# EAGLE design UPTC (EAGLE 9.5.2)
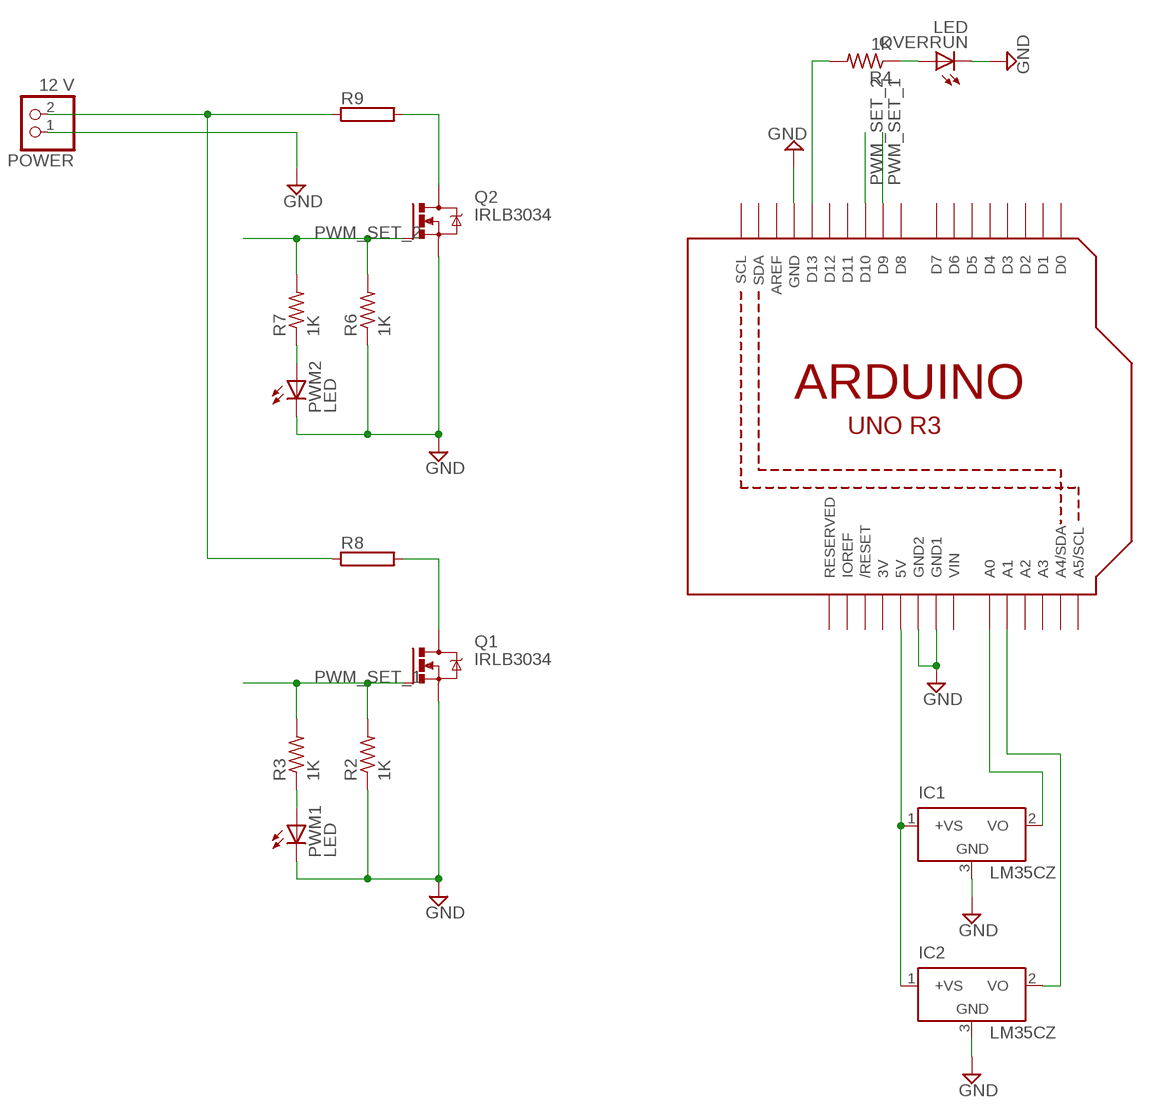
[diagram p0: schematic, sheet 1]

## Parts
IC1  LM35CZ  [TO92]
IC2  LM35CZ  [TO92]
OVERRUN  LED  LED5MM  [LED5MM]
POWER  12 V  PINHD-1X2  [1X02]
PWM1  LED  LED5MM  [LED5MM]
PWM2  LED  LED5MM  [LED5MM]
Q1  IRLB3034  IRF520  [TO220BV]
Q2  IRLB3034  IRF520  [TO220BV]
R2  1K  R-US_0207/10  [0207/10]
R3  1K  R-US_0207/10  [0207/10]
R4  1K  R-US_0207/10  [0207/10]
R6  1K  R-US_0207/10  [0207/10]
R7  1K  R-US_0207/10  [0207/10]
R8  RAC05  [AC05]
R9  RAC05  [AC05]
U2  ARDUINOR3-BPLACE  [ARDUINOR3-BPLACE]

## Nets
GND: IC1.3(GND) IC2.3(GND) OVERRUN.K(C) POWER.1 PWM1.K(C) PWM2.K(C) Q1.S Q2.S R2.1 R6.1 U2.GND U2.GND1 U2.GND2
N$2: Q1.D R8.2
N$4: IC1.2(VO) U2.A0
N$5: R4.2 U2.D13
N$6: PWM1.A R3.1
N$7: OVERRUN.A R4.1
N$8: IC2.2(VO) U2.A1
N$9: Q2.D R9.2
N$10: PWM2.A R7.1
N$11: POWER.2 R8.1 R9.1
PWM_SET_1: Q1.G R2.2 R3.2 U2.D9
PWM_SET_2: Q2.G R6.2 R7.2 U2.D10
VCC: IC1.1(+VS) IC2.1(+VS) U2.5V
Unconnected: U2.A2 U2.A3 U2.A4(A4/SDA) U2.A5(A5/SCL) U2.AREF U2.D0 U2.D1 U2.D2 U2.D3 U2.D4 U2.D5 U2.D6 U2.D7 U2.D8 U2.D11 U2.D12 U2.IOREF U2.RESERVED U2.RESET(/RESET) U2.SCL U2.SDA

## Power pins joined to a net without a drawn wire
3V: U2.3V
VIN: U2.VIN

## Library data of the parts
IC1 IC2 = lm35:LM35: Single-Supply Centigrade Temperature Sensor Vout = (10mV/°C x Temp °C) +5mmmV Source: http://www.national.com/ds/LM/LM35.pdf
OVERRUN PWM1 PWM2 = adafruit:LED: LED OSRAM: - CHIPLED LG R971, LG N971, LY N971, LG Q971, LY Q971, LO R971, LY R971 LH N974, LH R974 LS Q976, LO Q976, LY Q976 LO Q996 - Hyper CHIPLED LW Q18S LB Q993, LB Q99A, LB R99A - SideLED LS A670, LO A670, LY A670, LG A670, LP A670 LB A673, LV A673, LT A673, LW A673 LH A674 LY A675 LS A676, LA A676, LO A676, LY A676, LW A676 LS A679, LY A679, LG A679 - Hyper Micro SIDELED® LS Y876, LA Y876, LO Y876, LY Y876 LT Y87S - SmartLED LW L88C, LW L88S LB L89C, LB L89S, LG L890 LS L89K, LO L89K, LY L89K LS L896, LA L896, LO L896, LY L896 - TOPLED LS T670, LO T670, LY T670, LG T670, LP T670 LSG T670, LSP T670, LSY T670, LOP T670, LYG T670 LG T671, LOG T671, LSG T671 LB T673, LV T673, LT T673, LW T673 LH T674 LS T676, LA T676, LO T676, LY T676, LB T676, LH T676, LSB T676, LW T676 LB T67C, LV T67C, LT T67C, LS T67K, LO T67K, LY T67K, LW E67C LS E67B, LA E67B, LO E67B, LY E67B, LB E67C, LV E67C, LT E67C LW T67C LS T679, LY T679, LG T679 LS T770, LO T770, LY T770, LG T770, LP T770 LB T773, LV T773, LT T773, LW T773 LH T774 LS E675, LA E675, LY E675, LS T675 LS T776, LA T776, LO T776, LY T776, LB T776 LHGB T686 LT T68C, LB T68C - Hyper Mini TOPLED® LB M676 - Mini TOPLED Santana® LG M470 LS M47K, LO M47K, LY M47K Source: http://www.osram.convergy.de/
POWER = pinhead:PINHD-1X2: PIN HEADER
Q1 Q2 = transistor-power:IRF520: HEXFET Power MOSFET
R2-R4 R6 R7 = adafruit:R-US_: RESISTOR, American symbol
R8 R9 = resistor-power:R: Power Resitor; OC_FARNELL: unknown; OC_NEWARK: unknown
U2 = adafruit:ARDUINOR3: This is a new object for the new Arduino R3 - with extra pins that you may want to use (such as IOref, and duplicated A4/A5

## Board
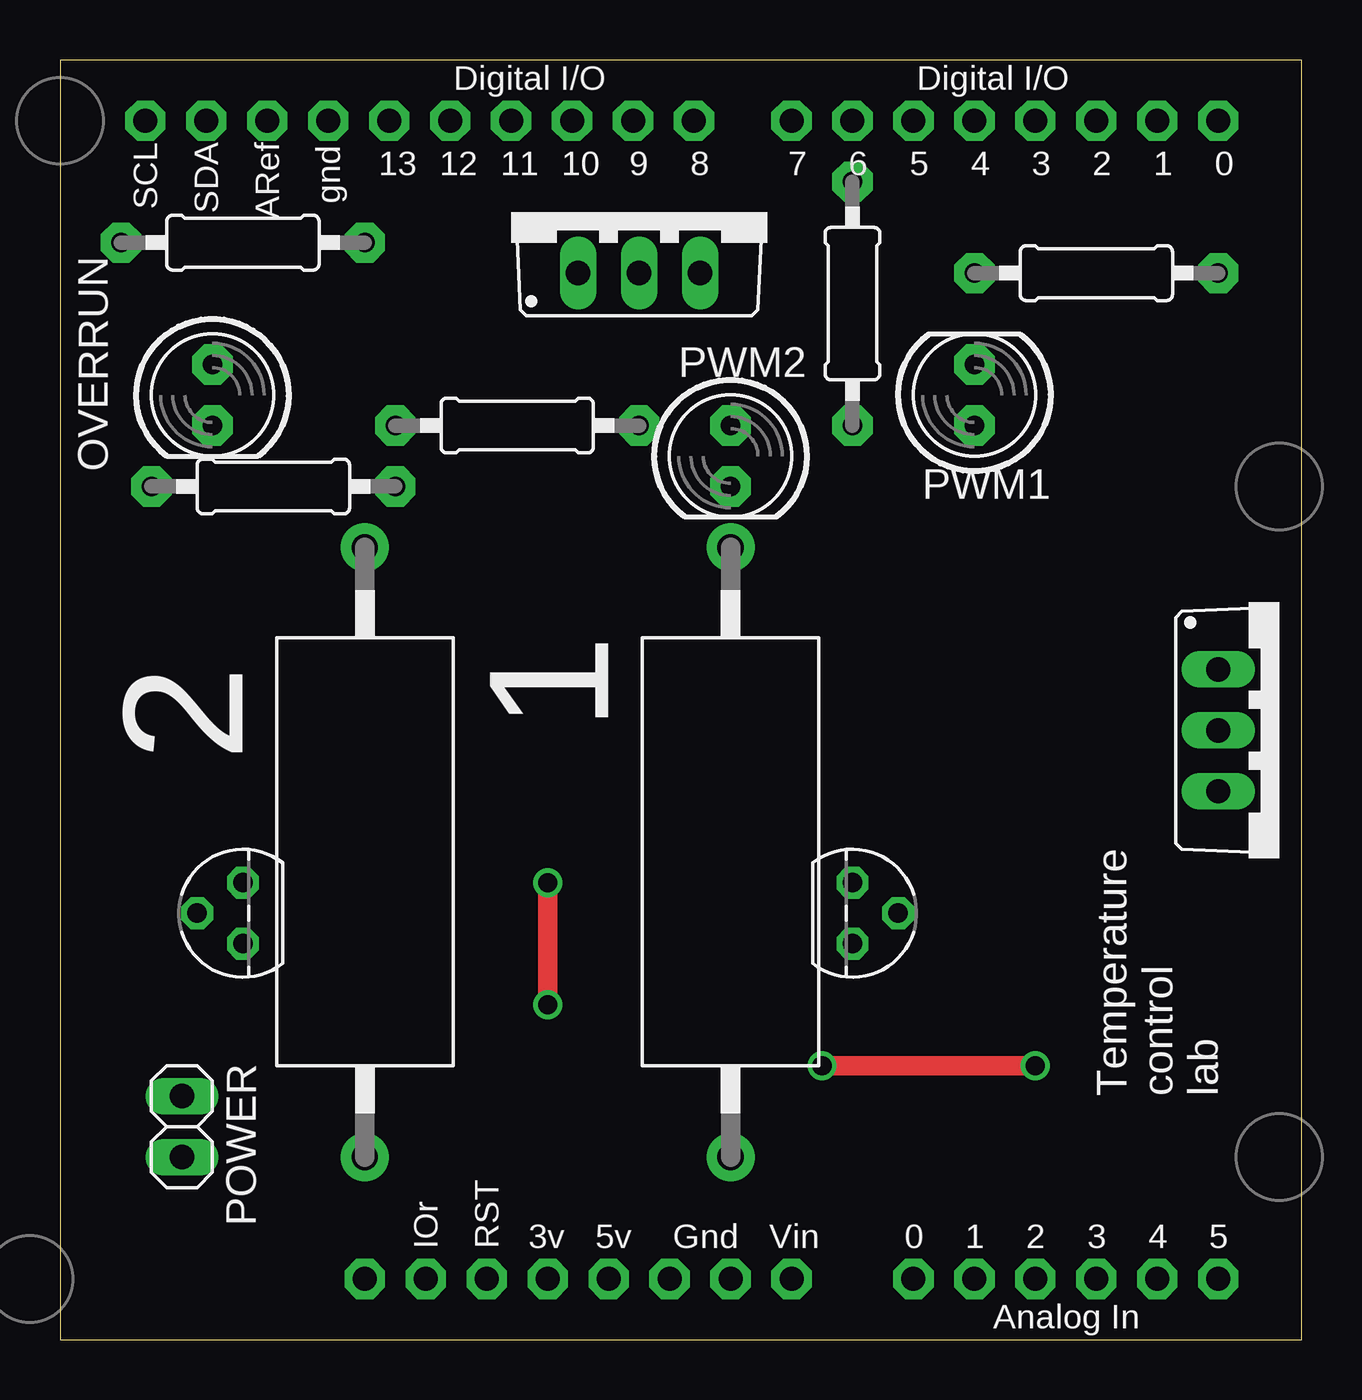
[diagram p1: board, top side]
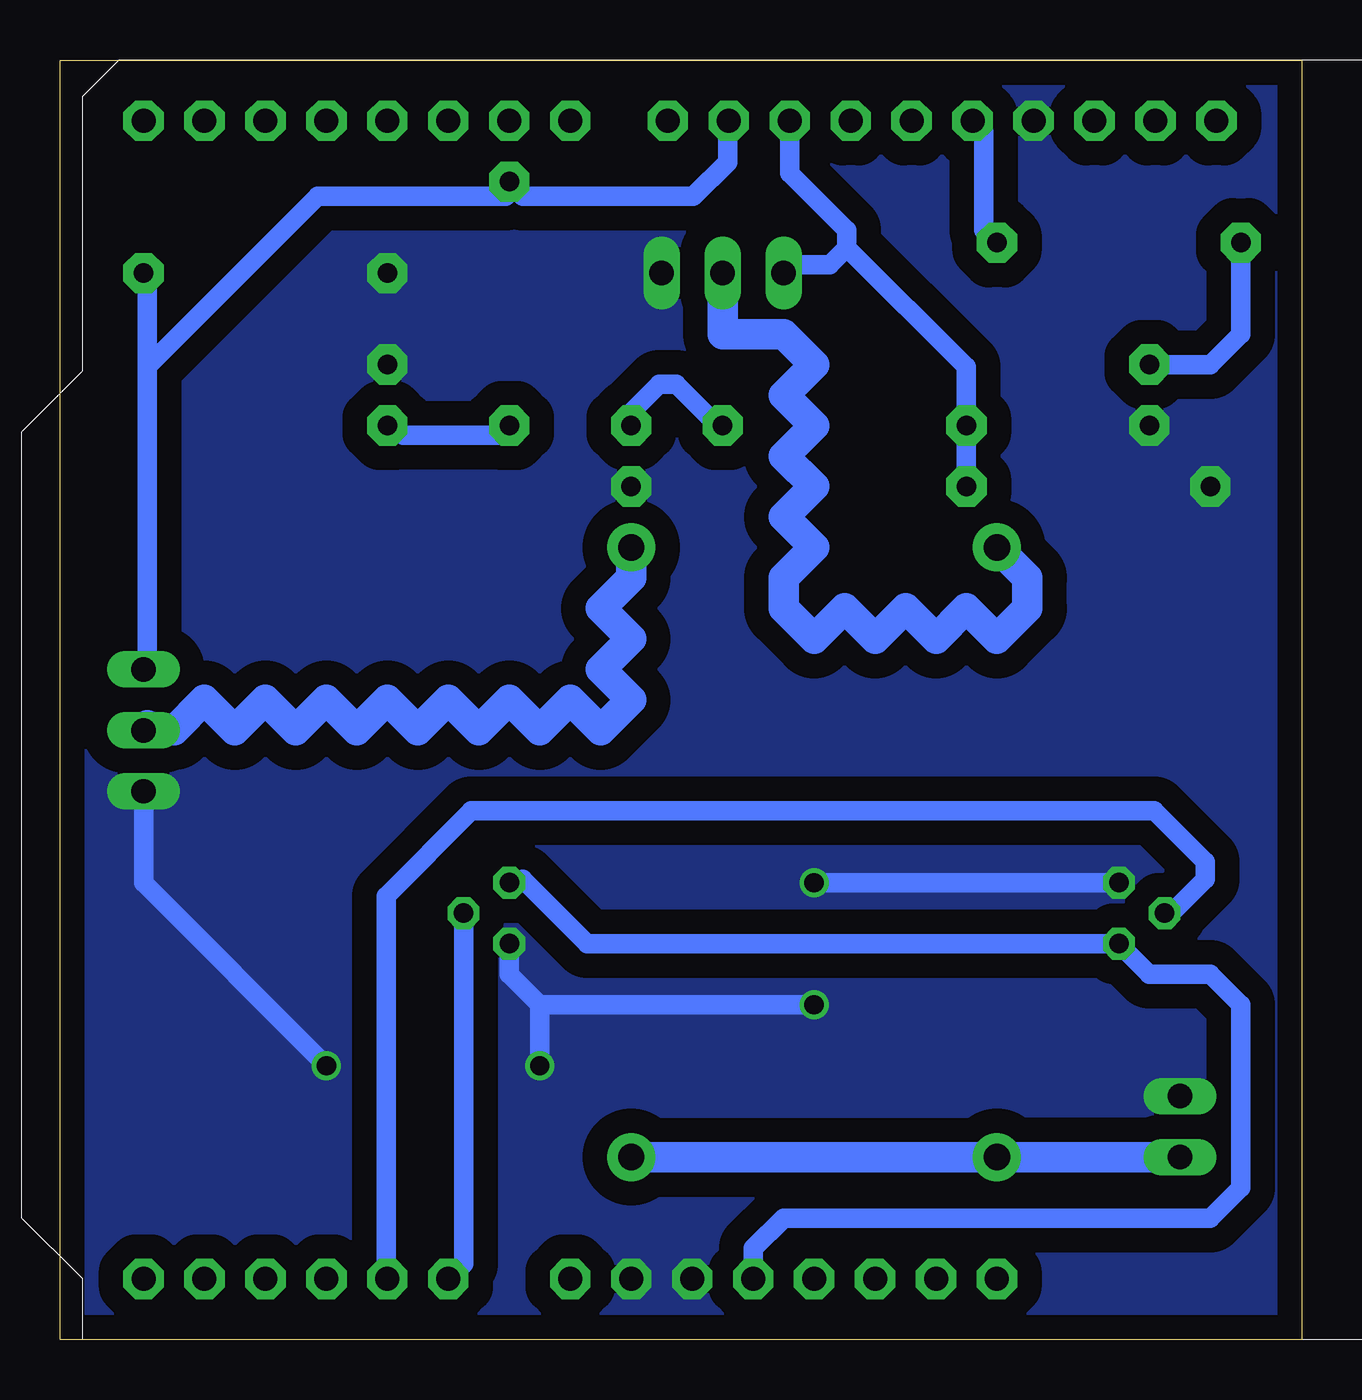
[diagram p2: board, bottom side, seen from below]

Size 51.74 x 53.33 mm. Coordinates in mm from the lower left corner, seen from the top.
Outline: 0,0 51.74,0 51.74,53.33 0,53.33 0,0
Copper layers (1*16): Top 0.035mm / dielectric 1.5mm / Bottom 0.035mm
Design rules "default *": minimum track width 32mil, minimum drill 0.8mm, track to track 24mil, track to pad 24mil, pad to pad 24mil, via to via 24mil, smd to smd 6mil, copper to edge 40mil, drill to drill 6mil, minimum pad ring 10mil, minimum via ring 8mil, stop-mask expansion 4mil, vias tented up to drill 0mil, thermal gap 0mil

### Footprints (pad centres in the part's own frame; a part is rotated, then mirrored left to right if it is on the bottom)
TO92 = drill 0.813 octagon: 1 -1.27,0; 2 0,1.905; 3 1.27,0
LED5MM = drill 0.813 pad 1.676 octagon: A -1.27,0; K 1.27,0
1X02 = drill 1.016 long: 1 -1.27,0; 2 1.27,0
TO220BV = drill 1.016 long: D 0,-2.54; G -2.54,-2.54; S 2.54,-2.54
0207/10 = drill 0.813 pad 1.676 octagon: 1 -5.08,0; 2 5.08,0
AC05 = drill 1.1 pad 2: 1 -12.7,0; 2 12.7,0
ARDUINOR3-BPLACE = drill 1 pad 1.676 octagon: 3V 35.56,2.54; 5V 38.1,2.54; A0 50.8,2.54; A1 53.34,2.54; A2 55.88,2.54; A3 58.42,2.54; A4 60.96,2.54; A5 63.5,2.54; AREF 23.876,50.8; D0 63.5,50.8; D1 60.96,50.8; D2 58.42,50.8; D3 55.88,50.8; D4 53.34,50.8; D5 50.8,50.8; D6 48.26,50.8; D7 45.72,50.8; D8 41.656,50.8; D9 39.116,50.8; D10 36.576,50.8; D11 34.036,50.8; D12 31.496,50.8; D13 28.956,50.8; GND 26.416,50.8; GND1 43.18,2.54; GND2 40.64,2.54; IOREF 30.48,2.54; RESERVED 27.94,2.54; RESET 33.02,2.54; SCL 18.796,50.8; SDA 21.336,50.8; VIN 45.72,2.54

### Placement (x,y rotation side)
IC1  33.02,17.78 270 top
IC2  7.62,17.78 90 top
OVERRUN  6.35,39.37 270 top
POWER  5.08,8.89 270 top
PWM1  38.1,39.37 90 top
PWM2  27.94,36.83 270 top
Q1  50.8,25.4 270 top
Q2  24.13,46.99 0 top
R2  43.18,44.45 0 top
R3  33.02,43.18 90 top
R4  7.62,45.72 0 top
R6  8.89,35.56 0 top
R7  19.05,38.1 180 top
R8  27.94,20.32 90 top
R9  12.7,20.32 90 top
U2  -15.24,0 0 top

### Tracks (layer width: path | path; a pad name or v marks a point on that pad's centre or on a via)
GND  (via drill 0.8)
  Top 0.813: v20.32,19.05 v20.32,13.97 | v31.75,11.43 v40.64,11.43
  Bottom 0.813: IC2.3 v20.32,19.05 | 31.75,13.97 33.02,15.24 IC1.3 | v20.32,13.97 31.75,13.97 | 31.75,13.97 v31.75,11.43 | v40.64,11.43 48.26,19.05 Q1.S
  pour Bottom (isolate 1.016): 0,53.34 52.07,53.34 52.07,0 0,0
N$2
  Bottom 0.813: 47.4,25.6 48.11,25.6 47.9,25.4 46.99,25.4
  Bottom 1.27: 48.11,25.6 Q1.D | 46.99,25.4 45.72,26.67 44.45,25.4 43.18,26.67 41.91,25.4 40.64,26.67 39.37,25.4 38.1,26.67 36.83,25.4 35.56,26.67 34.29,25.4 33.02,26.67 31.75,25.4 30.48,26.67 29.21,25.4 27.94,26.67 29.21,27.94 27.94,29.21 29.21,30.48 27.94,31.75 R8.2
N$4
  Bottom 0.813: IC1.2 34.92,3.17 U2.A0
N$5
  Bottom 0.813: R4.2 13.26,46.23 13.26,50.34 U2.D13
N$6
  Bottom 0.813: R3.1 33.17,37.69 37.44,37.69 PWM1.A
N$7
  Bottom 0.813: R4.1 2.54,41.91 3.81,40.64 OVERRUN.A
N$8
  Bottom 0.813: IC2.2 5.44,17.78 4.01,19.2 4.01,19.91 6.15,22.05 34.59,22.05 38.15,18.49 38.15,2.85 U2.A1
N$9
  Bottom 1.27: Q2.D 24.13,41.91 21.59,41.91 20.32,40.64 21.59,39.37 20.32,38.1 21.59,36.83 20.32,35.56 21.59,34.29 20.32,33.02 21.59,31.75 21.59,30.48 20.32,29.21 19.05,30.48 17.78,29.21 16.51,30.48 15.24,29.21 13.97,30.48 12.7,29.21 11.43,30.48 11.43,31.75 R9.2
N$10
  Bottom 0.813: R7.1 24.64,38.41 26.06,39.83 26.77,39.83 28.19,38.41 PWM2.A
N$11
  Bottom 0.813: 12.55,7.67 R9.1 | 27.48,7.67 R8.1
  Bottom 1.27: R8.1 R9.1 POWER.2
PWM_SET_1
  Bottom 0.813: U2.D9 23.93,50.49 23.93,49.07 25.35,47.65 32.46,47.65 R3.2 33.17,47.65 41,47.65 48.11,40.54 | 48.11,40.54 48.11,44.09 R2.2 | 48.11,40.54 48.11,28.45 Q1.G
PWM_SET_2
  Bottom 0.813: Q2.G 21.08,44.81 19.66,44.81 18.95,45.52 | 13.97,37.69 R7.2 | 18.95,45.52 18.95,46.23 21.34,48.62 U2.D10 | R6.2 R7.2 | R7.2 13.97,40.54 18.95,45.52
VCC
  Bottom 0.813: IC1.1 32.46,19.2 29.77,16.51 IC2.1 6.35,15.24 3.81,15.24 2.54,13.97 2.54,6.35 3.81,5.08 21.59,5.08 22.86,3.81 U2.5V

### Text on the board
tPlace: 1 | 2 | Temperature / control / lab